# EAGLE schematic TMP37_0402 (EAGLE 7.5.0)
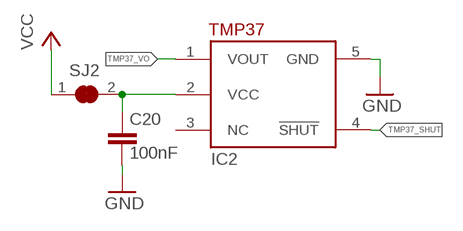
[diagram p0: schematic, sheet 1]

## Parts
C20  100nF  C-EUC0402  [C0402]
IC2  TMP37GRTZ-REEL7  TMP37  [SOT-23-5]
SJ2  SOLDERJUMPER_CLOSED  [SOLDERJUMPER_CLOSEDWIRE]

## Nets
GND: C20.2 IC2.5(GND)
N$4: C20.1 IC2.2(VCC) SJ2.2
TMP37_SHUT: IC2.4(!SHUT)
TMP37_VO: IC2.1(VOUT)
VCC: SJ2.1
Unconnected: IC2.3(NC)

## Library data of the parts
C20 = rcl@1:C-EU: CAPACITOR, European symbol; SPICEPREFIX: C
IC2 = TMP37:TMP37
SJ2 = microbuilder:SOLDERJUMPER_CLOSED: Solder Jumper - Closed These solder jumpers are closed by default CLOSEDWIRE - 10 mil trace between pads that can be cut and resoldered later CLOSEDPERM - 63 mil trace between pads for a permanent connection (used to 'bridge' two signals, a shameless hack for Eagle). Can double as a test point as well (no cream layer)